# EAGLE schematic lhs (EAGLE 7.5.0)
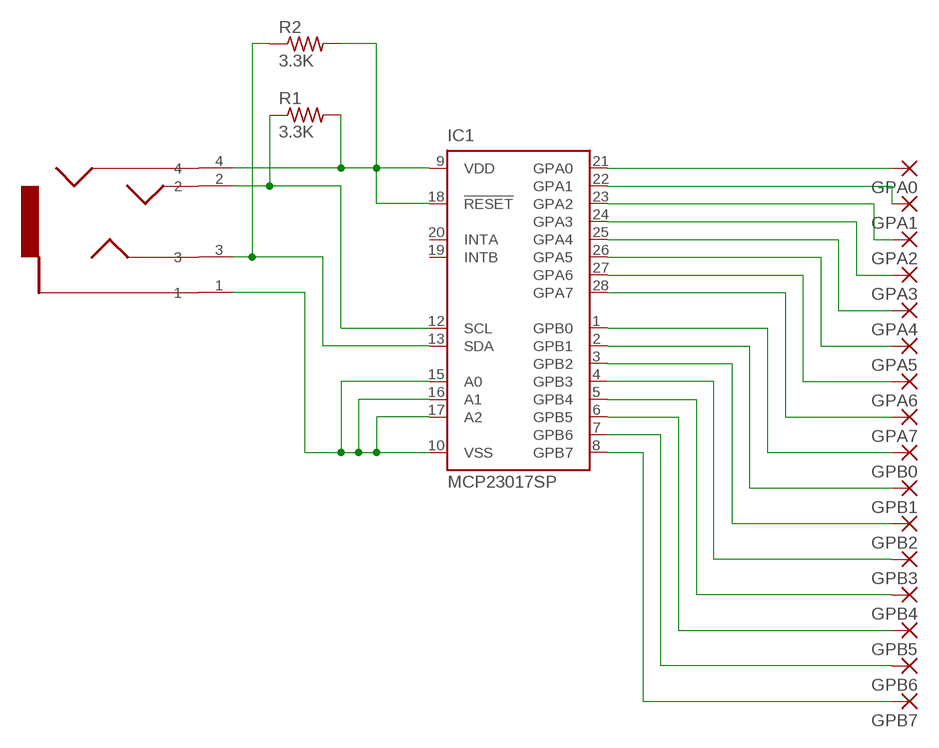
[diagram p0: schematic, sheet 1]

## Parts
GPA0  1,6/0,8  [1,6/0,8]
GPA1  1,6/0,8  [1,6/0,8]
GPA2  1,6/0,8  [1,6/0,8]
GPA3  1,6/0,8  [1,6/0,8]
GPA4  1,6/0,8  [1,6/0,8]
GPA5  1,6/0,8  [1,6/0,8]
GPA6  1,6/0,8  [1,6/0,8]
GPA7  1,6/0,8  [1,6/0,8]
GPB0  1,6/0,8  [1,6/0,8]
GPB1  1,6/0,8  [1,6/0,8]
GPB2  1,6/0,8  [1,6/0,8]
GPB3  1,6/0,8  [1,6/0,8]
GPB4  1,6/0,8  [1,6/0,8]
GPB5  1,6/0,8  [1,6/0,8]
GPB6  1,6/0,8  [1,6/0,8]
GPB7  1,6/0,8  [1,6/0,8]
IC1  MCP23017SP  [DIL28-3]
R1  3.3K  R-US_0207/10  [0207/10]
R2  3.3K  R-US_0207/10  [0207/10]
U$1  SJ-43514_HEADPHONES_3.5MM_X4  [SJ-43514_HEADPHONES-3.5MM_X4]

## Nets
N$1: IC1.9(VDD) IC1.18(!RESET) R1.2 R2.2 U$1.4
N$2: IC1.10(VSS) IC1.15(A0) IC1.16(A1) IC1.17(A2) U$1.1
N$3: IC1.12(SCL) R1.1 U$1.2
N$4: IC1.13(SDA) R2.1 U$1.3
N$5: GPA0.1(P) IC1.21(GPA0)
N$6: GPA1.1(P) IC1.22(GPA1)
N$7: GPA2.1(P) IC1.23(GPA2)
N$8: GPA3.1(P) IC1.24(GPA3)
N$9: GPA4.1(P) IC1.25(GPA4)
N$10: GPA5.1(P) IC1.26(GPA5)
N$11: GPA6.1(P) IC1.27(GPA6)
N$12: GPA7.1(P) IC1.28(GPA7)
N$13: GPB0.1(P) IC1.1(GPB0)
N$14: GPB1.1(P) IC1.2(GPB1)
N$15: GPB2.1(P) IC1.3(GPB2)
N$16: GPB3.1(P) IC1.4(GPB3)
N$17: GPB4.1(P) IC1.5(GPB4)
N$18: GPB5.1(P) IC1.6(GPB5)
N$19: GPB6.1(P) IC1.7(GPB6)
N$20: GPB7.1(P) IC1.8(GPB7)
Unconnected: IC1.19(INTB) IC1.20(INTA)

## Library data of the parts
GPA0 GPA1-GPA7 GPB0 GPB1-GPB7 = wirepad:1,6/0,8: THROUGH-HOLE PAD
IC1 = microchip:MCP23017: http://ww1.microchip.com/downloads/en/DeviceDoc/21952a.pdf Source: http://ww1.microchip.com/downloads/en/DeviceDoc/21952a.pdf; MF: MICROCHIP; MPN: MCP23017-E/SP; OC_FARNELL: 1332088; OC_NEWARK: 31K2959
R1 R2 = adafruit:R-US_: RESISTOR, American symbol
U$1 = my_parts:SJ-43514_HEADPHONES_3.5MM_X4: This is for the SJ-43514 3.5mm 4-conductor headphone jack. Also works with SJ-4351X and SJ-43515TS